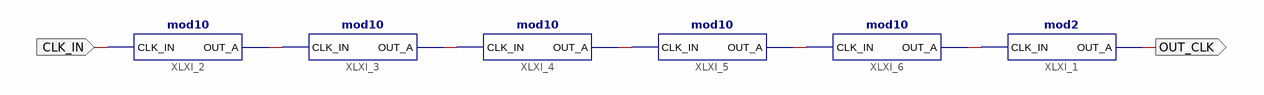
[diagram p0: schematic sheet 1]
// Xilinx ISE schematic mod200000.sch (spartan6) as structural Verilog: 6 symbols, 2 ports
module mod200000 (
  input  CLK_IN,
  output OUT_CLK
);

  wire XLXN_1, XLXN_2, XLXN_3, XLXN_4, XLXN_9;

  mod2 XLXI_1 (.CLK_IN(XLXN_9), .OUT_A(OUT_CLK));
  mod10 XLXI_3 (.CLK_IN(XLXN_1), .OUT_A(XLXN_2));
  mod10 XLXI_2 (.CLK_IN(CLK_IN), .OUT_A(XLXN_1));
  mod10 XLXI_4 (.CLK_IN(XLXN_2), .OUT_A(XLXN_3));
  mod10 XLXI_5 (.CLK_IN(XLXN_3), .OUT_A(XLXN_4));
  mod10 XLXI_6 (.CLK_IN(XLXN_4), .OUT_A(XLXN_9));
endmodule
